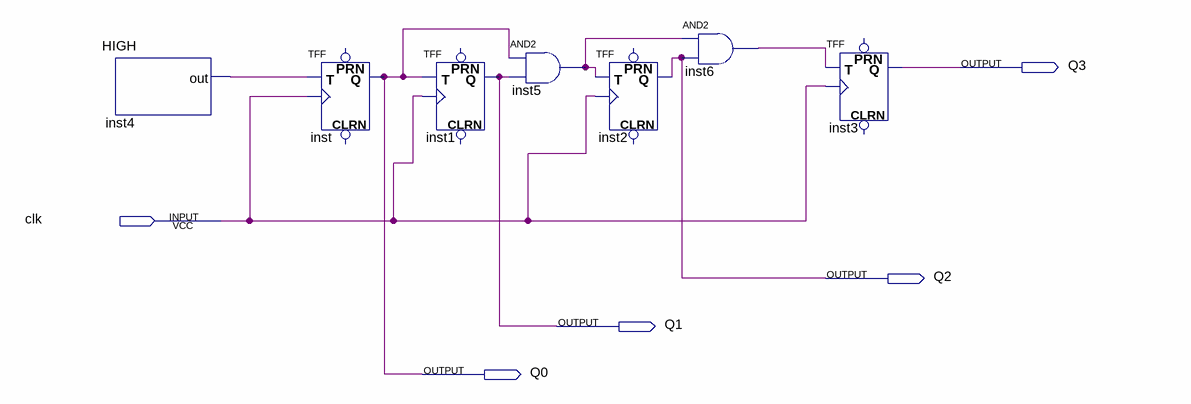
[diagram p0: schematic sheet]
// Quartus schematic counter4.bdf as structural Verilog: 7 symbols, 5 pins
module counter4 (
  input  clk,
  output Q3,
  output Q2,
  output Q1,
  output Q0
);

  wire inst4_out, inst5_out, inst6_out;

  HIGH inst4 (.out(inst4_out));
  TFF inst (.T(inst4_out), .CLK(clk), .Q(Q0));  // open: PRN, CLRN
  TFF inst1 (.T(Q0), .CLK(clk), .Q(Q1));  // open: PRN, CLRN
  and inst5 (inst5_out, Q0, Q1);
  TFF inst2 (.T(inst5_out), .CLK(clk), .Q(Q2));  // open: PRN, CLRN
  and inst6 (inst6_out, inst5_out, Q2);
  TFF inst3 (.T(inst6_out), .CLK(clk), .Q(Q3));  // open: PRN, CLRN
endmodule
